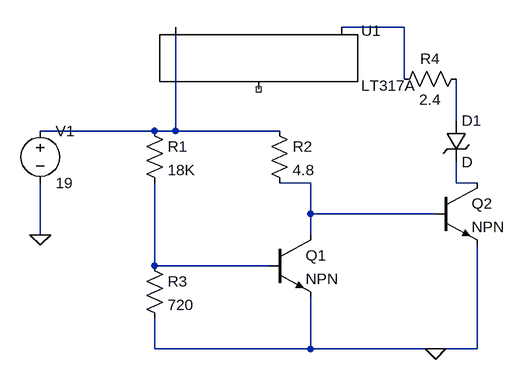
[diagram p0: schematic Overvoltage protection (NPN).asc]
Overvoltage protection (NPN).asc, the LTspice schematic file:
Version 4
SHEET 1 880 680
WIRE 624 -64 528 -64
WIRE 624 16 624 -64
WIRE 704 80 704 16
WIRE 240 96 64 96
WIRE 272 96 272 -64
WIRE 272 96 240 96
WIRE 432 96 272 96
WIRE 480 176 432 176
WIRE 704 176 704 144
WIRE 736 176 704 176
WIRE 480 224 480 176
WIRE 672 224 480 224
WIRE 64 256 64 176
WIRE 480 256 480 224
WIRE 240 304 240 176
WIRE 416 304 240 304
WIRE 240 432 240 384
WIRE 480 432 480 352
WIRE 480 432 240 432
WIRE 672 432 480 432
WIRE 736 432 736 272
WIRE 736 432 672 432
FLAG 64 256 0
FLAG 672 432 0
SYMBOL voltage 64 80 R0
WINDOW 123 0 0 Left 0
WINDOW 39 0 0 Left 0
SYMATTR InstName V1
SYMATTR Value 19
SYMBOL res 224 80 R0
SYMATTR InstName R1
SYMATTR Value 18K
SYMBOL res 416 80 R0
SYMATTR InstName R2
SYMATTR Value 4.8
SYMBOL res 224 288 R0
SYMATTR InstName R3
SYMATTR Value 720
SYMBOL res 720 0 R90
WINDOW 0 0 56 VBottom 2
WINDOW 3 32 56 VTop 2
SYMATTR InstName R4
SYMATTR Value 2.4
SYMBOL npn 416 256 R0
SYMATTR InstName Q1
SYMBOL npn 672 176 R0
SYMATTR InstName Q2
SYMBOL PowerProducts\\LT317A 400 -64 R0
SYMATTR InstName U1
SYMBOL zener 688 80 R0
SYMATTR InstName D1

The netlist it stands for:
* Overvoltage protection (NPN).asc
V1 N003 0 19
R1 N003 N006 18K
R2 N003 N004 4.8
R3 N006 0 720
R4 N002 N001 2.4
Q1 N004 N006 0 0 NPN
Q2 N005 N004 0 0 NPN
XU1 NC_01 N001 N003 LT317A
D1 N002 N005 D
.model D D
.lib standard.dio
.model NPN NPN
.model PNP PNP
.lib standard.bjt
.lib LTC.lib
.backanno
.end